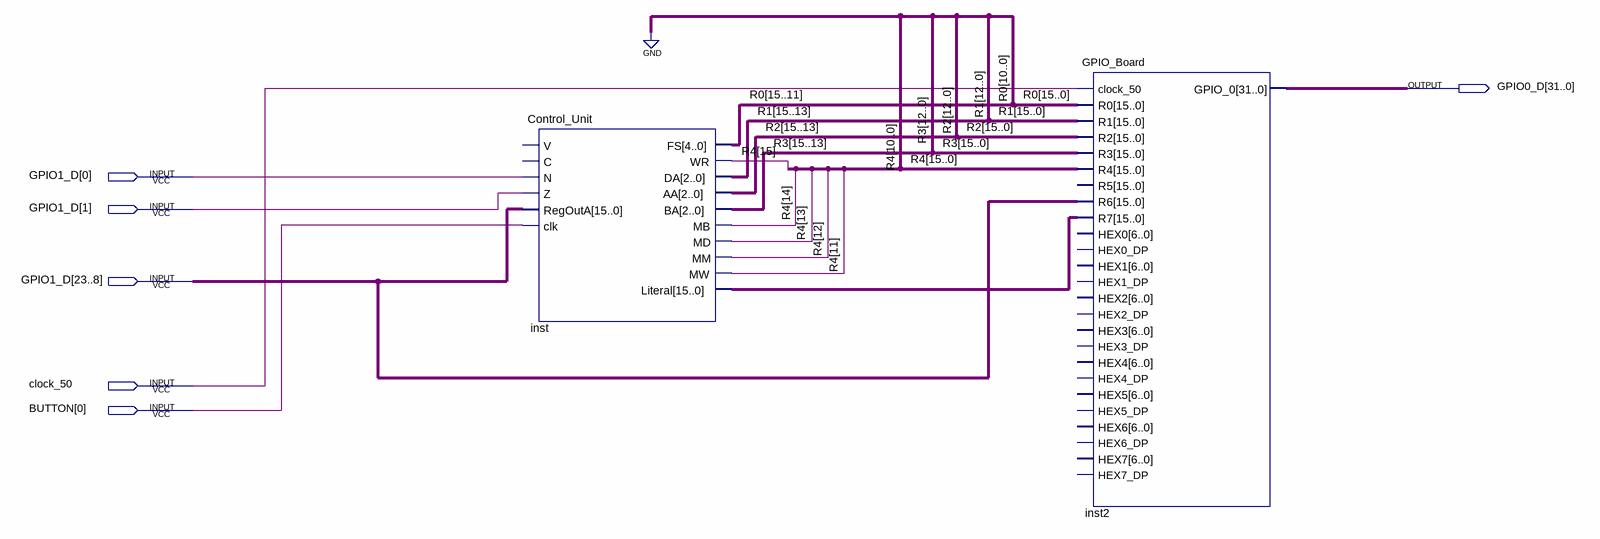
[diagram p0: schematic sheet]
// Quartus schematic Control_Unit_Test.bdf as structural Verilog: 2 symbols, 6 pins
module Control_Unit_Test (
  input  [23:0] GPIO1_D,
  input  clock_50,
  input  [0:0] BUTTON,
  output [31:0] GPIO0_D
);

  wire [15:0] inst_literal, R0, R1, R2, R4;
  wire [15:13] R3;

  Control_Unit inst (
    .N(GPIO1_D[0]), .Z(GPIO1_D[1]), .RegOutA(GPIO1_D[23:8]), .clk(BUTTON[0]), .FS(R0[15:11]), .WR(R4[15]),
    .DA(R1[15:13]), .AA(R2[15:13]), .BA(R3), .MB(R4[14]), .MD(R4[13]), .MM(R4[12]), .MW(R4[11]),
    .Literal(inst_literal));  // open: V, C
  GPIO_Board inst2 (
    .clock_50(clock_50), .R0(R0), .R1(R1), .R2(R2), .R3({R3, {13{1'b0}}}), .R4(R4), .R6(GPIO1_D[23:8]),
    .R7(inst_literal), .GPIO_0(GPIO0_D));  // open: R5, HEX0, HEX0_DP, HEX1, HEX1_DP, HEX2, HEX2_DP, HEX3, HEX3_DP, HEX4, HEX4_DP, HEX5, HEX5_DP, HEX6, HEX6_DP, HEX7, HEX7_DP
endmodule
